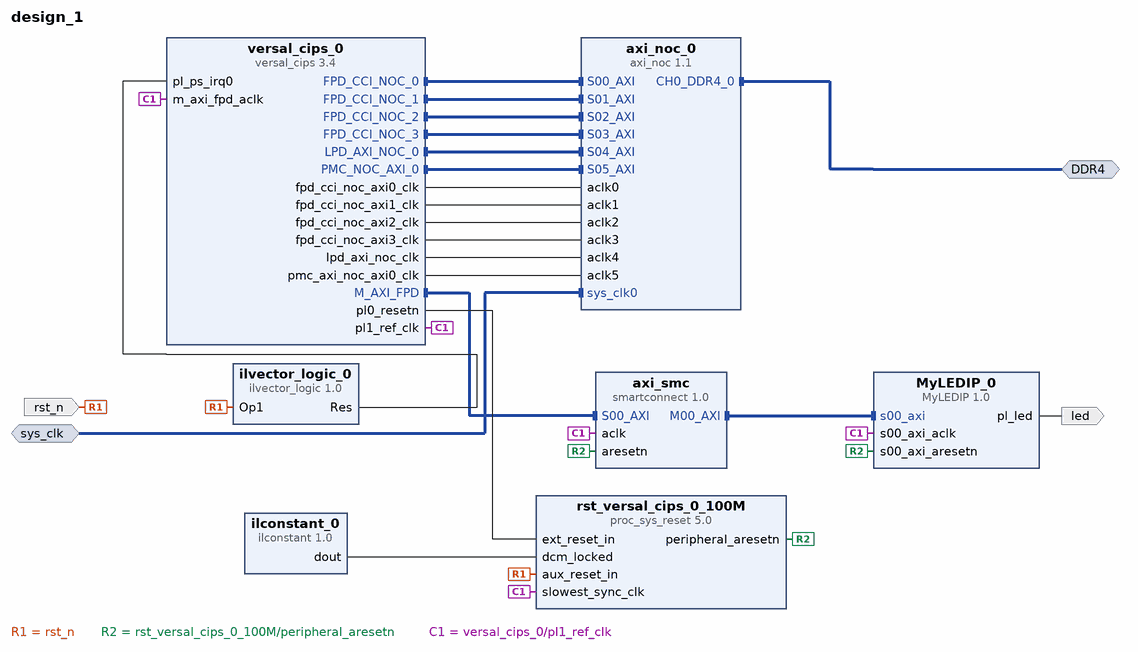
[diagram p0: block diagram of the top level]
# Vivado block design design_1, xcve2302-sfva784-1LP-e-S, Vivado 2025.2
create_bd_design design_1

create_bd_intf_port -mode Master -vlnv xilinx.com:interface:ddr4_rtl:1.0 DDR4
create_bd_intf_port -mode Slave -vlnv xilinx.com:interface:diff_clock_rtl:1.0 sys_clk
set_property -dict {CONFIG.FREQ_HZ 200000000} [get_bd_intf_ports sys_clk]
create_bd_port -dir O led
create_bd_port -dir I -type rst rst_n
set_property -dict {CONFIG.POLARITY ACTIVE_LOW} [get_bd_ports rst_n]

create_bd_cell -type ip -vlnv xilinx.com:ip:versal_cips:3.4 versal_cips_0
set_property -dict [list \
  CONFIG.BOOT_MODE Custom \
  CONFIG.CLOCK_MODE Custom \
  CONFIG.DDR_MEMORY_MODE Enable \
  CONFIG.DEBUG_MODE Custom \
  CONFIG.DESIGN_MODE 1 \
  CONFIG.DEVICE_INTEGRITY_MODE Custom \
  CONFIG.IO_CONFIG_MODE Custom \
  CONFIG.PS_PL_CONNECTIVITY_MODE Custom \
  CONFIG.PS_PMC_CONFIG {['BOOT_MODE Custom', 'CLOCK_MODE Custom', 'DDR_MEMORY_MODE {Connectivity to DDR via NOC}', 'DESIGN_MODE 1', 'DEVICE_INTEGRITY_MODE Custom', 'IO_CONFIG_MODE Custom', 'PMC_CLKMON0_CONFIG {{BASE 10000} {BASE_CLK_SRC REF_CLK} {CLKA_FREQ 1000} {CLKA_SEL REF_CLK} {ENABLE 0} {INTR 0} {THRESHOLD_L 0} {THRESHOLD_U 0}}', 'PMC_CRP_PL0_REF_CTRL_FREQMHZ 240', 'PMC_CRP_PL1_REF_CTRL_FREQMHZ 100', 'PMC_GPIO_EMIO_PERIPHERAL_ENABLE 0', 'PMC_I2CPMC_PERIPHERAL {{ENABLE 1} {IO {PMC_MIO 34 .. 35}}}', 'PMC_QSPI_FBCLK {{ENABLE 1} {IO {PMC_MIO 6}}}', 'PMC_QSPI_PERIPHERAL_DATA_MODE x4', 'PMC_QSPI_PERIPHERAL_ENABLE 1', 'PMC_QSPI_PERIPHERAL_MODE {Dual Parallel}', 'PMC_REF_CLK_FREQMHZ 33.333333', 'PMC_SD0 {{CD_ENABLE 0} {CD_IO {PMC_MIO 24}} {POW_ENABLE 0} {POW_IO {PMC_MIO 17}} {RESET_ENABLE 1} {RESET_IO {PMC_MIO 49}} {WP_ENABLE 0} {WP_IO {PMC_MIO 25}}}', 'PMC_SD0_DATA_TRANSFER_MODE 8Bit', 'PMC_SD0_PERIPHERAL {{CLK_100_SDR_OTAP_DLY 0x00} {CLK_200_SDR_OTAP_DLY 0x00} {CLK_50_DDR_ITAP_DLY 0x00} {CLK_50_DDR_OTAP_DLY 0x00} {CLK_50_SDR_ITAP_DLY 0x2C} {CLK_50_SDR_OTAP_DLY 0x4} {ENABLE 1} {IO {PMC_MIO 37 .. 49}}}', 'PMC_SD0_SLOT_TYPE eMMC', 'PMC_SD1 {{CD_ENABLE 1} {CD_IO {PMC_MIO 28}} {POW_ENABLE 0} {POW_IO {PMC_MIO 12}} {RESET_ENABLE 0} {RESET_IO {PMC_MIO 12}} {WP_ENABLE 0} {WP_IO {PMC_MIO 1}}}', 'PMC_SD1_PERIPHERAL {{CLK_100_SDR_OTAP_DLY 0x00} {CLK_200_SDR_OTAP_DLY 0x00} {CLK_50_DDR_ITAP_DLY 0x00} {CLK_50_DDR_OTAP_DLY 0x00} {CLK_50_SDR_ITAP_DLY 0x2C} {CLK_50_SDR_OTAP_DLY 0x4} {ENABLE 1} {IO {PMC_MIO 26 .. 36}}}', 'PMC_SD1_SLOT_TYPE {SD 2.0}', 'PMC_USE_NOC_PMC_AXI0 0', 'PMC_USE_PMC_NOC_AXI0 1', 'PS_BOARD_INTERFACE Custom', 'PS_CRL_GEM0_REF_CTRL_FREQMHZ 125', 'PS_ENET0_MDIO {{ENABLE 1} {IO {PMC_MIO 50 .. 51}}}', 'PS_ENET0_PERIPHERAL {{ENABLE 1} {IO {PS_MIO 0 .. 11}}}', 'PS_ENET1_MDIO {{ENABLE 0} {IO {PMC_MIO 50 .. 51}}}', 'PS_ENET1_PERIPHERAL {{ENABLE 0} {IO {PMC_MIO 38 .. 49}}}', 'PS_GEM_TSU_CLK_PORT_PAIR 0', 'PS_GEN_IPI0_ENABLE 1', 'PS_GEN_IPI1_ENABLE 1', 'PS_GEN_IPI2_ENABLE 1', 'PS_GEN_IPI3_ENABLE 1', 'PS_GEN_IPI4_ENABLE 1', 'PS_GEN_IPI5_ENABLE 1', 'PS_GEN_IPI6_ENABLE 1', 'PS_GPIO_EMIO_PERIPHERAL_ENABLE 1', 'PS_I2C0_PERIPHERAL {{ENABLE 0} {IO {PS_MIO 2 .. 3}}}', 'PS_I2C1_PERIPHERAL {{ENABLE 0} {IO {PS_MIO 0 .. 1}}}', 'PS_I2CSYSMON_PERIPHERAL {{ENABLE 0} {IO {PS_MIO 23 .. 24}}}', 'PS_IRQ_USAGE {{CH0 1} {CH1 0} {CH10 0} {CH11 0} {CH12 0} {CH13 0} {CH14 0} {CH15 0} {CH2 0} {CH3 0} {CH4 0} {CH5 0} {CH6 0} {CH7 0} {CH8 0} {CH9 0}}', 'PS_MIO24 {{AUX_IO 0} {DIRECTION in} {DRIVE_STRENGTH 8mA} {OUTPUT_DATA default} {PULL pullup} {SCHMITT 0} {SLEW slow} {USAGE GPIO}}', 'PS_MIO25 {{AUX_IO 0} {DIRECTION out} {DRIVE_STRENGTH 8mA} {OUTPUT_DATA default} {PULL pullup} {SCHMITT 0} {SLEW slow} {USAGE GPIO}}', 'PS_NUM_FABRIC_RESETS 1', 'PS_PL_CONNECTIVITY_MODE Custom', 'PS_SPI0 {{GRP_SS0_ENABLE 0} {GRP_SS0_IO {PMC_MIO 15}} {GRP_SS1_ENABLE 0} {GRP_SS1_IO {PMC_MIO 14}} {GRP_SS2_ENABLE 0} {GRP_SS2_IO {PMC_MIO 13}} {PERIPHERAL_ENABLE 0} {PERIPHERAL_IO {PMC_MIO 12 .. 17}}}', 'PS_SPI1 {{GRP_SS0_ENABLE 0} {GRP_SS0_IO {PS_MIO 9}} {GRP_SS1_ENABLE 0} {GRP_SS1_IO {PS_MIO 8}} {GRP_SS2_ENABLE 0} {GRP_SS2_IO {PS_MIO 7}} {PERIPHERAL_ENABLE 0} {PERIPHERAL_IO {PS_MIO 6 .. 11}}}', 'PS_TTC0_CLK {{ENABLE 0} {IO {PS_MIO 6}}}', 'PS_TTC0_PERIPHERAL_ENABLE 1', 'PS_TTC1_PERIPHERAL_ENABLE 1', 'PS_TTC2_PERIPHERAL_ENABLE 1', 'PS_TTC3_PERIPHERAL_ENABLE 1', 'PS_UART0_PERIPHERAL {{ENABLE 1} {IO {PS_MIO 16 .. 17}}}', 'PS_USB3_PERIPHERAL {{ENABLE 1} {IO {PMC_MIO 13 .. 25}}}', 'PS_USE_ENET0_PTP 0', 'PS_USE_ENET1_PTP 0', 'PS_USE_FIFO_ENET0 0', 'PS_USE_FPD_AXI_NOC0 0', 'PS_USE_FPD_CCI_NOC 1', 'PS_USE_FPD_CCI_NOC0 1', 'PS_USE_M_AXI_FPD 1', 'PS_USE_M_AXI_LPD 0', 'PS_USE_NOC_FPD_AXI0 0', 'PS_USE_NOC_LPD_AXI0 1', 'PS_USE_PMCPL_CLK0 1', 'PS_USE_PMCPL_CLK1 1', 'PS_USE_PMCPL_CLK2 0', 'PS_USE_PMCPL_CLK3 0', 'PS_USE_PSPL_IRQ_LPD 0', 'PS_USE_S_AXI_FPD 0', 'PS_USE_S_AXI_LPD 0', 'SMON_ALARMS Set_Alarms_On', 'SMON_ENABLE_TEMP_AVERAGING 0', 'SMON_INTERFACE_TO_USE None', 'SMON_MEAS0 {{ALARM_ENABLE 0} {ALARM_LOWER 0.00} {ALARM_UPPER 2.00} {AVERAGE_EN 0} {ENABLE 0} {MODE {2 V unipolar}} {NAME GTYP_AVCCAUX_103} {SUPPLY_NUM 0}}', 'SMON_MEAS1 {{ALARM_ENABLE 0} {ALARM_LOWER 0.00} {ALARM_UPPER 2.00} {AVERAGE_EN 0} {ENABLE 0} {MODE {2 V unipolar}} {NAME GTYP_AVCCAUX_104} {SUPPLY_NUM 0}}', 'SMON_MEAS10 {{ALARM_ENABLE 0} {ALARM_LOWER 0.00} {ALARM_UPPER 4.00} {AVERAGE_EN 0} {ENABLE 0} {MODE {4 V unipolar}} {NAME VCCO_302} {SUPPLY_NUM 0}}', 'SMON_MEAS11 {{ALARM_ENABLE 0} {ALARM_LOWER 0.00} {ALARM_UPPER 4.00} {AVERAGE_EN 0} {ENABLE 0} {MODE {4 V unipolar}} {NAME VCCO_500} {SUPPLY_NUM 0}}', 'SMON_MEAS12 {{ALARM_ENABLE 0} {ALARM_LOWER 0.00} {ALARM_UPPER 4.00} {AVERAGE_EN 0} {ENABLE 0} {MODE {4 V unipolar}} {NAME VCCO_501} {SUPPLY_NUM 0}}', 'SMON_MEAS13 {{ALARM_ENABLE 0} {ALARM_LOWER 0.00} {ALARM_UPPER 4.00} {AVERAGE_EN 0} {ENABLE 0} {MODE {4 V unipolar}} {NAME VCCO_502} {SUPPLY_NUM 0}}', 'SMON_MEAS14 {{ALARM_ENABLE 0} {ALARM_LOWER 0.00} {ALARM_UPPER 4.00} {AVERAGE_EN 0} {ENABLE 0} {MODE {4 V unipolar}} {NAME VCCO_503} {SUPPLY_NUM 0}}', 'SMON_MEAS15 {{ALARM_ENABLE 0} {ALARM_LOWER 0.00} {ALARM_UPPER 2.00} {AVERAGE_EN 0} {ENABLE 0} {MODE {2 V unipolar}} {NAME VCCO_700} {SUPPLY_NUM 0}}', 'SMON_MEAS16 {{ALARM_ENABLE 0} {ALARM_LOWER 0.00} {ALARM_UPPER 2.00} {AVERAGE_EN 0} {ENABLE 0} {MODE {2 V unipolar}} {NAME VCCO_701} {SUPPLY_NUM 0}}', 'SMON_MEAS17 {{ALARM_ENABLE 0} {ALARM_LOWER 0.00} {ALARM_UPPER 2.00} {AVERAGE_EN 0} {ENABLE 0} {MODE {2 V unipolar}} {NAME VCCO_702} {SUPPLY_NUM 0}}', 'SMON_MEAS18 {{ALARM_ENABLE 0} {ALARM_LOWER 0.00} {ALARM_UPPER 2.00} {AVERAGE_EN 0} {ENABLE 0} {MODE {2 V unipolar}} {NAME VCCO_703} {SUPPLY_NUM 0}}', 'SMON_MEAS19 {{ALARM_ENABLE 0} {ALARM_LOWER 0.00} {ALARM_UPPER 2.00} {AVERAGE_EN 0} {ENABLE 0} {MODE {2 V unipolar}} {NAME VCC_BATT} {SUPPLY_NUM 0}}', 'SMON_MEAS2 {{ALARM_ENABLE 0} {ALARM_LOWER 0.00} {ALARM_UPPER 2.00} {AVERAGE_EN 0} {ENABLE 0} {MODE {2 V unipolar}} {NAME GTYP_AVCC_103} {SUPPLY_NUM 0}}', 'SMON_MEAS20 {{ALARM_ENABLE 0} {ALARM_LOWER 0.00} {ALARM_UPPER 2.00} {AVERAGE_EN 0} {ENABLE 0} {MODE {2 V unipolar}} {NAME VCC_PMC} {SUPPLY_NUM 0}}', 'SMON_MEAS21 {{ALARM_ENABLE 0} {ALARM_LOWER 0.00} {ALARM_UPPER 2.00} {AVERAGE_EN 0} {ENABLE 0} {MODE {2 V unipolar}} {NAME VCC_PSFP} {SUPPLY_NUM 0}}', 'SMON_MEAS22 {{ALARM_ENABLE 0} {ALARM_LOWER 0.00} {ALARM_UPPER 2.00} {AVERAGE_EN 0} {ENABLE 0} {MODE {2 V unipolar}} {NAME VCC_PSLP} {SUPPLY_NUM 0}}', 'SMON_MEAS23 {{ALARM_ENABLE 0} {ALARM_LOWER 0.00} {ALARM_UPPER 2.00} {AVERAGE_EN 0} {ENABLE 0} {MODE {2 V unipolar}} {NAME VCC_RAM} {SUPPLY_NUM 0}}', 'SMON_MEAS24 {{ALARM_ENABLE 0} {ALARM_LOWER 0.00} {ALARM_UPPER 2.00} {AVERAGE_EN 0} {ENABLE 0} {MODE {2 V unipolar}} {NAME VCC_SOC} {SUPPLY_NUM 0}}', 'SMON_MEAS25 {{ALARM_ENABLE 0} {ALARM_LOWER 0.00} {ALARM_UPPER 2.00} {AVERAGE_EN 0} {ENABLE 0} {MODE {1 V unipolar}} {NAME VP_VN} {SUPPLY_NUM 0}}', 'SMON_MEAS3 {{ALARM_ENABLE 0} {ALARM_LOWER 0.00} {ALARM_UPPER 2.00} {AVERAGE_EN 0} {ENABLE 0} {MODE {2 V unipolar}} {NAME GTYP_AVCC_104} {SUPPLY_NUM 0}}', 'SMON_MEAS4 {{ALARM_ENABLE 0} {ALARM_LOWER 0.00} {ALARM_UPPER 2.00} {AVERAGE_EN 0} {ENABLE 0} {MODE {2 V unipolar}} {NAME GTYP_AVTT_103} {SUPPLY_NUM 0}}', 'SMON_MEAS5 {{ALARM_ENABLE 0} {ALARM_LOWER 0.00} {ALARM_UPPER 2.00} {AVERAGE_EN 0} {ENABLE 0} {MODE {2 V unipolar}} {NAME GTYP_AVTT_104} {SUPPLY_NUM 0}}', 'SMON_MEAS6 {{ALARM_ENABLE 0} {ALARM_LOWER 0.00} {ALARM_UPPER 2.00} {AVERAGE_EN 0} {ENABLE 0} {MODE {2 V unipolar}} {NAME VCCAUX} {SUPPLY_NUM 0}}', 'SMON_MEAS7 {{ALARM_ENABLE 0} {ALARM_LOWER 0.00} {ALARM_UPPER 2.00} {AVERAGE_EN 0} {ENABLE 0} {MODE {2 V unipolar}} {NAME VCCAUX_PMC} {SUPPLY_NUM 0}}', 'SMON_MEAS8 {{ALARM_ENABLE 0} {ALARM_LOWER 0.00} {ALARM_UPPER 2.00} {AVERAGE_EN 0} {ENABLE 0} {MODE {2 V unipolar}} {NAME VCCAUX_SMON} {SUPPLY_NUM 0}}', 'SMON_MEAS9 {{ALARM_ENABLE 0} {ALARM_LOWER 0.00} {ALARM_UPPER 2.00} {AVERAGE_EN 0} {ENABLE 0} {MODE {2 V unipolar}} {NAME VCCINT} {SUPPLY_NUM 0}}', 'SMON_PMBUS_ADDRESS 0x0', 'SMON_TEMP_AVERAGING_SAMPLES 0', 'SMON_VOLTAGE_AVERAGING_SAMPLES None']} \
] [get_bd_cells versal_cips_0]
create_bd_cell -type ip -vlnv xilinx.com:ip:axi_noc:1.1 axi_noc_0
set_property -dict [list \
  CONFIG.CONTROLLERTYPE DDR4_SDRAM \
  CONFIG.MC_CHAN_REGION0 DDR_LOW0 \
  CONFIG.MC_CHAN_REGION1 NONE \
  CONFIG.MC_COMPONENT_WIDTH x16 \
  CONFIG.MC_EN_INTR_RESP TRUE \
  CONFIG.MC_INPUTCLK0_PERIOD 5000 \
  CONFIG.MC_MEMORY_SPEEDGRADE {DDR4-3200AA(22-22-22)} \
  CONFIG.MC_PRE_DEF_ADDR_MAP_SEL ROW_BANK_COLUMN_BGO \
  CONFIG.NUM_CLKS 6 \
  CONFIG.NUM_MC 1 \
  CONFIG.NUM_MCP 4 \
  CONFIG.NUM_MI 0 \
  CONFIG.NUM_SI 6 \
] [get_bd_cells axi_noc_0]
create_bd_cell -type ip -vlnv xilinx.com:ip:proc_sys_reset:5.0 rst_versal_cips_0_100M
create_bd_cell -type inline_hdl -vlnv xilinx.com:inline_hdl:ilconstant:1.0 ilconstant_0
create_bd_cell -type ip -vlnv xilinx.com:user:MyLEDIP:1.0 MyLEDIP_0
create_bd_cell -type ip -vlnv xilinx.com:ip:smartconnect:1.0 axi_smc
set_property -dict {CONFIG.NUM_CLKS 1 CONFIG.NUM_SI 1} [get_bd_cells axi_smc]
create_bd_cell -type inline_hdl -vlnv xilinx.com:inline_hdl:ilvector_logic:1.0 ilvector_logic_0
set_property -dict {CONFIG.C_OPERATION not CONFIG.C_SIZE 1} [get_bd_cells ilvector_logic_0]

# ---- connections ----

connect_bd_intf_net [get_bd_intf_ports DDR4] [get_bd_intf_pins axi_noc_0/CH0_DDR4_0]
connect_bd_intf_net [get_bd_intf_pins axi_smc/M00_AXI] [get_bd_intf_pins MyLEDIP_0/s00_axi]
connect_bd_intf_net -intf_net sys_clk0_0_1 [get_bd_intf_ports sys_clk] [get_bd_intf_pins axi_noc_0/sys_clk0]
connect_bd_intf_net [get_bd_intf_pins versal_cips_0/FPD_CCI_NOC_0] [get_bd_intf_pins axi_noc_0/S00_AXI]
connect_bd_intf_net [get_bd_intf_pins versal_cips_0/FPD_CCI_NOC_1] [get_bd_intf_pins axi_noc_0/S01_AXI]
connect_bd_intf_net [get_bd_intf_pins versal_cips_0/FPD_CCI_NOC_2] [get_bd_intf_pins axi_noc_0/S02_AXI]
connect_bd_intf_net [get_bd_intf_pins versal_cips_0/FPD_CCI_NOC_3] [get_bd_intf_pins axi_noc_0/S03_AXI]
connect_bd_intf_net [get_bd_intf_pins versal_cips_0/LPD_AXI_NOC_0] [get_bd_intf_pins axi_noc_0/S04_AXI]
connect_bd_intf_net [get_bd_intf_pins versal_cips_0/M_AXI_FPD] [get_bd_intf_pins axi_smc/S00_AXI]
connect_bd_intf_net [get_bd_intf_pins versal_cips_0/PMC_NOC_AXI_0] [get_bd_intf_pins axi_noc_0/S05_AXI]
connect_bd_net [get_bd_pins MyLEDIP_0/pl_led] [get_bd_ports led]
connect_bd_net [get_bd_pins ilconstant_0/dout] [get_bd_pins rst_versal_cips_0_100M/dcm_locked]
connect_bd_net [get_bd_pins ilvector_logic_0/Res] [get_bd_pins versal_cips_0/pl_ps_irq0]
connect_bd_net [get_bd_ports rst_n] [get_bd_pins rst_versal_cips_0_100M/aux_reset_in] [get_bd_pins ilvector_logic_0/Op1]
connect_bd_net [get_bd_pins rst_versal_cips_0_100M/peripheral_aresetn] [get_bd_pins axi_smc/aresetn] [get_bd_pins MyLEDIP_0/s00_axi_aresetn]
connect_bd_net [get_bd_pins versal_cips_0/fpd_cci_noc_axi0_clk] [get_bd_pins axi_noc_0/aclk0]
connect_bd_net [get_bd_pins versal_cips_0/fpd_cci_noc_axi1_clk] [get_bd_pins axi_noc_0/aclk1]
connect_bd_net [get_bd_pins versal_cips_0/fpd_cci_noc_axi2_clk] [get_bd_pins axi_noc_0/aclk2]
connect_bd_net [get_bd_pins versal_cips_0/fpd_cci_noc_axi3_clk] [get_bd_pins axi_noc_0/aclk3]
connect_bd_net [get_bd_pins versal_cips_0/lpd_axi_noc_clk] [get_bd_pins axi_noc_0/aclk4]
connect_bd_net [get_bd_pins versal_cips_0/pl0_resetn] [get_bd_pins rst_versal_cips_0_100M/ext_reset_in]
connect_bd_net [get_bd_pins versal_cips_0/pl1_ref_clk] \
  [get_bd_pins axi_smc/aclk] [get_bd_pins MyLEDIP_0/s00_axi_aclk] [get_bd_pins rst_versal_cips_0_100M/slowest_sync_clk] \
  [get_bd_pins versal_cips_0/m_axi_fpd_aclk]
connect_bd_net [get_bd_pins versal_cips_0/pmc_axi_noc_axi0_clk] [get_bd_pins axi_noc_0/aclk5]

# ---- address map ----
assign_bd_address -offset 0x0000000000000000 -range 2G -target_address_space [get_bd_addr_spaces versal_cips_0/FPD_CCI_NOC_0] [get_bd_addr_segs axi_noc_0/S00_AXI/C3_DDR_LOW0]
assign_bd_address -offset 0x0000000000000000 -range 2G -target_address_space [get_bd_addr_spaces versal_cips_0/FPD_CCI_NOC_1] [get_bd_addr_segs axi_noc_0/S01_AXI/C2_DDR_LOW0]
assign_bd_address -offset 0x0000000000000000 -range 2G -target_address_space [get_bd_addr_spaces versal_cips_0/FPD_CCI_NOC_2] [get_bd_addr_segs axi_noc_0/S02_AXI/C0_DDR_LOW0]
assign_bd_address -offset 0x0000000000000000 -range 2G -target_address_space [get_bd_addr_spaces versal_cips_0/FPD_CCI_NOC_3] [get_bd_addr_segs axi_noc_0/S03_AXI/C1_DDR_LOW0]
assign_bd_address -offset 0x0000000000000000 -range 2G -target_address_space [get_bd_addr_spaces versal_cips_0/LPD_AXI_NOC_0] [get_bd_addr_segs axi_noc_0/S04_AXI/C3_DDR_LOW0]
assign_bd_address -offset 0x000A4000000 -range 4K -target_address_space [get_bd_addr_spaces versal_cips_0/M_AXI_FPD] [get_bd_addr_segs MyLEDIP_0/s00_axi/reg0]
assign_bd_address -offset 0x0000000000000000 -range 2G -target_address_space [get_bd_addr_spaces versal_cips_0/PMC_NOC_AXI_0] [get_bd_addr_segs axi_noc_0/S05_AXI/C2_DDR_LOW0]

validate_bd_design
save_bd_design
